# EAGLE schematic main_board (EAGLE 9.6.2)
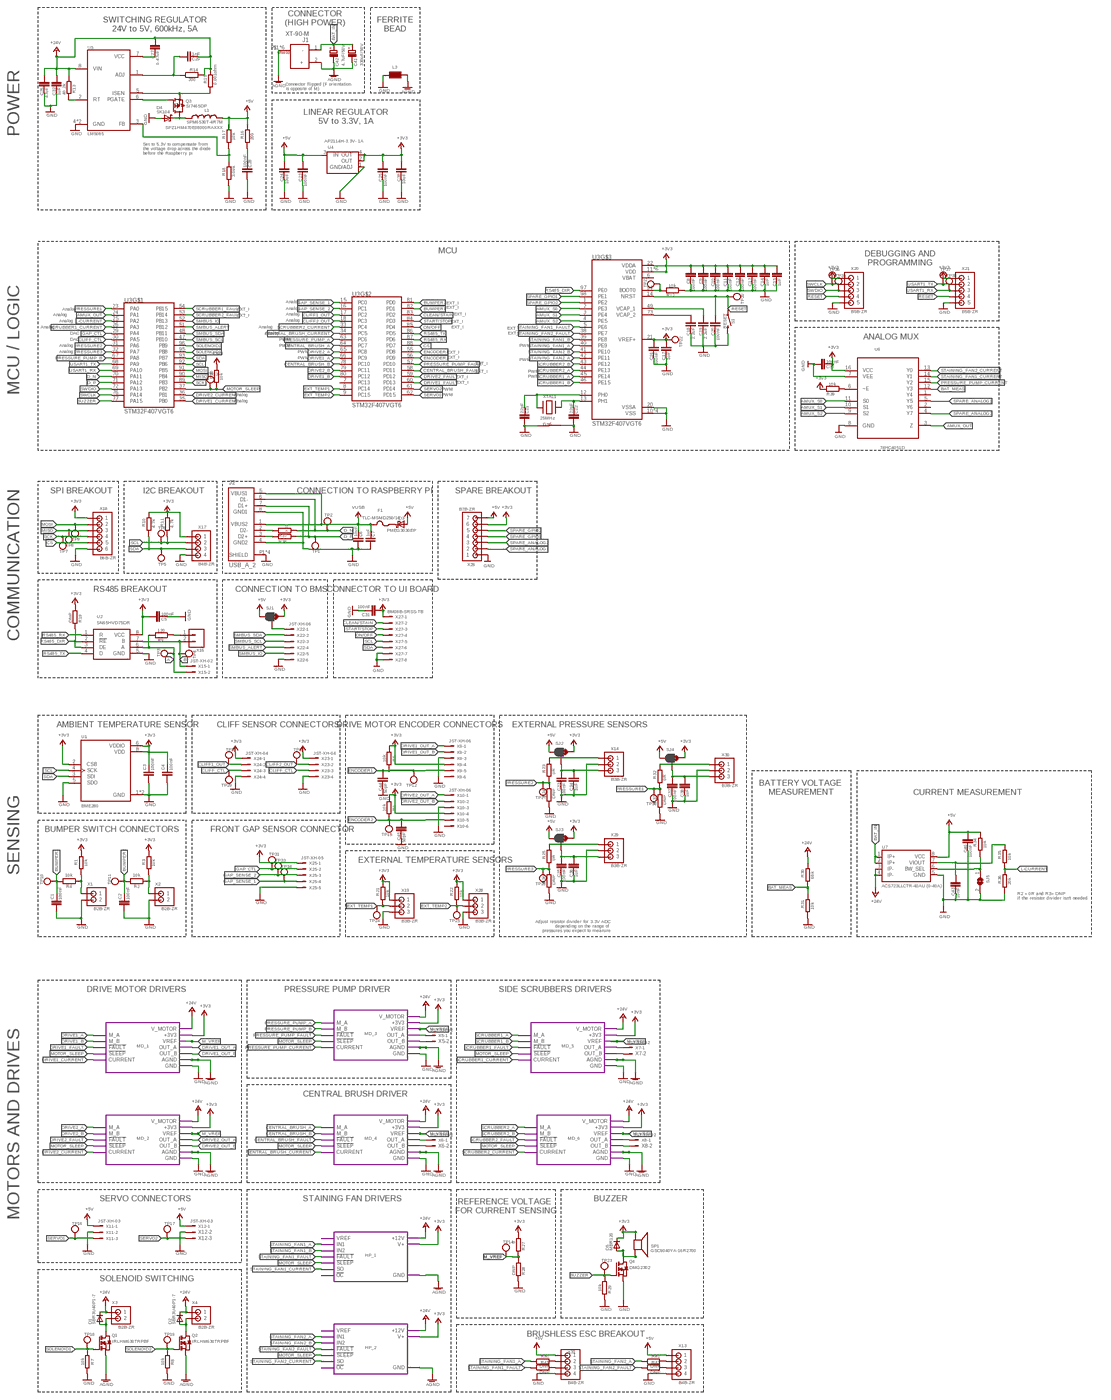
[diagram p0: schematic, sheet 1, overview]
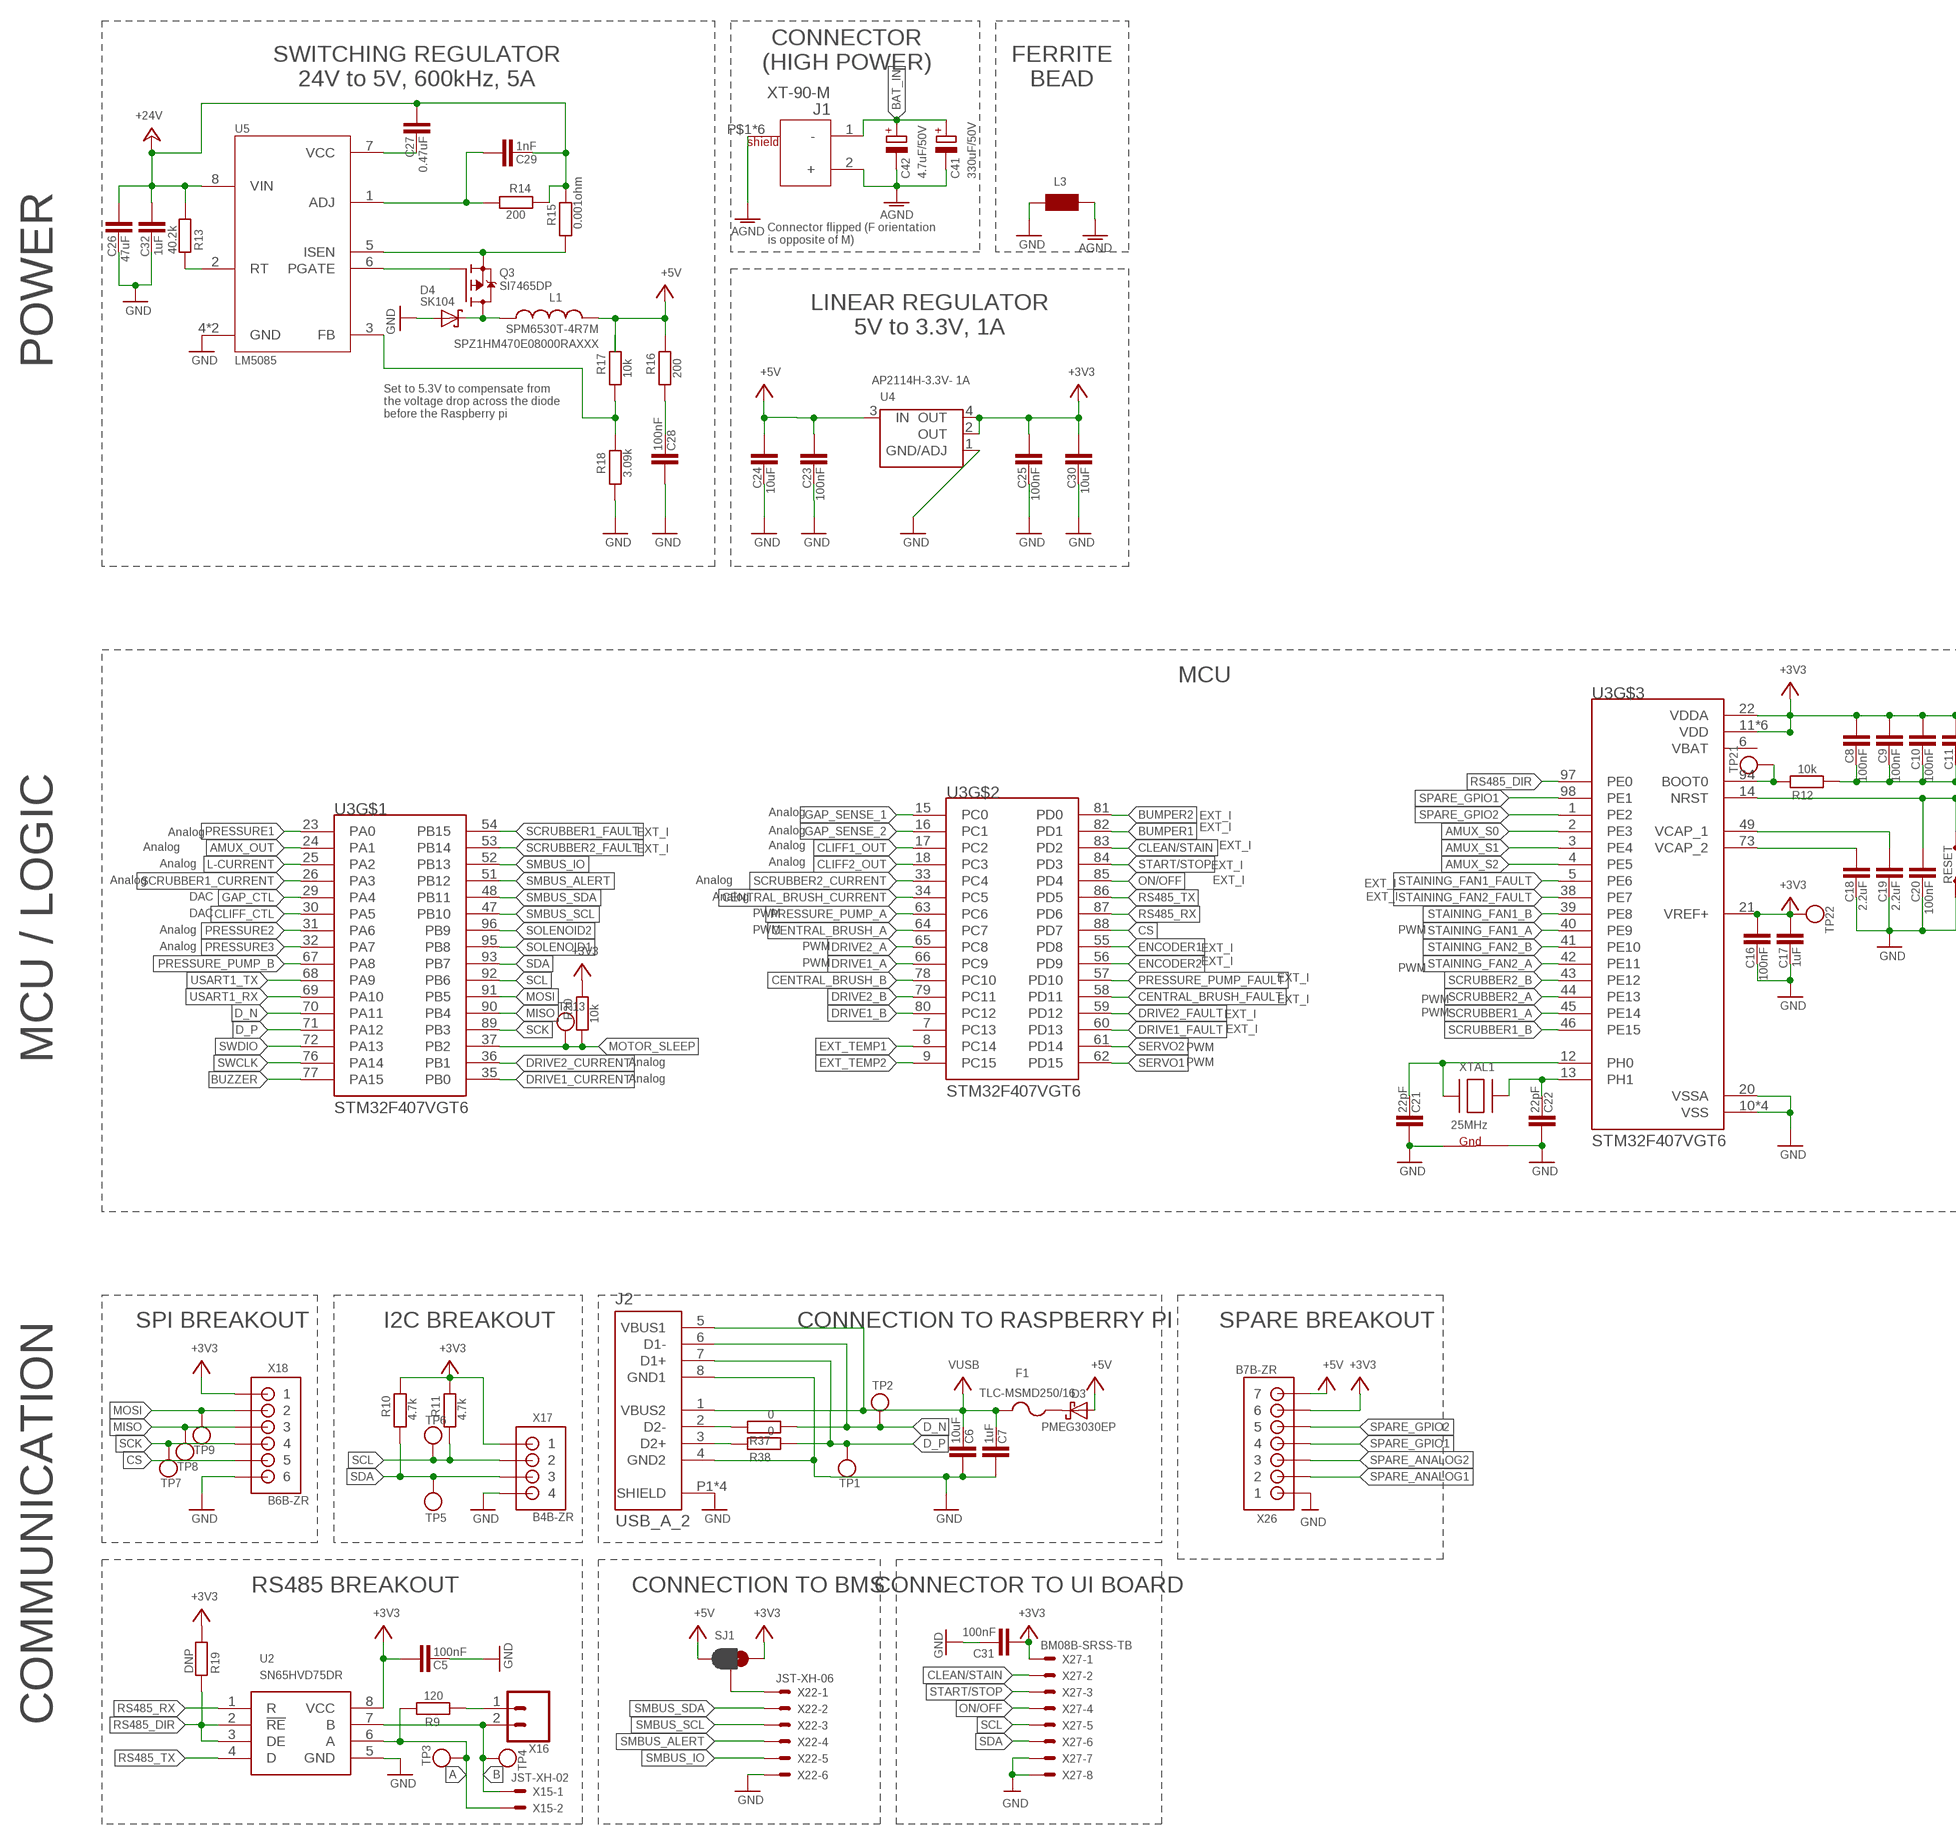
[diagram p1: schematic, sheet 1, part 1 of 4]
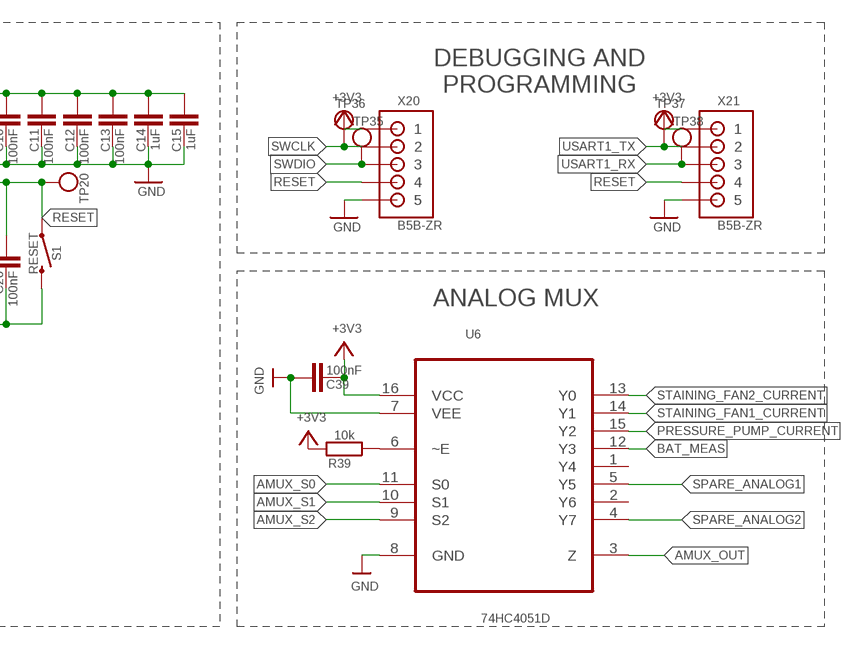
[diagram p2: schematic, sheet 1, part 2 of 4]
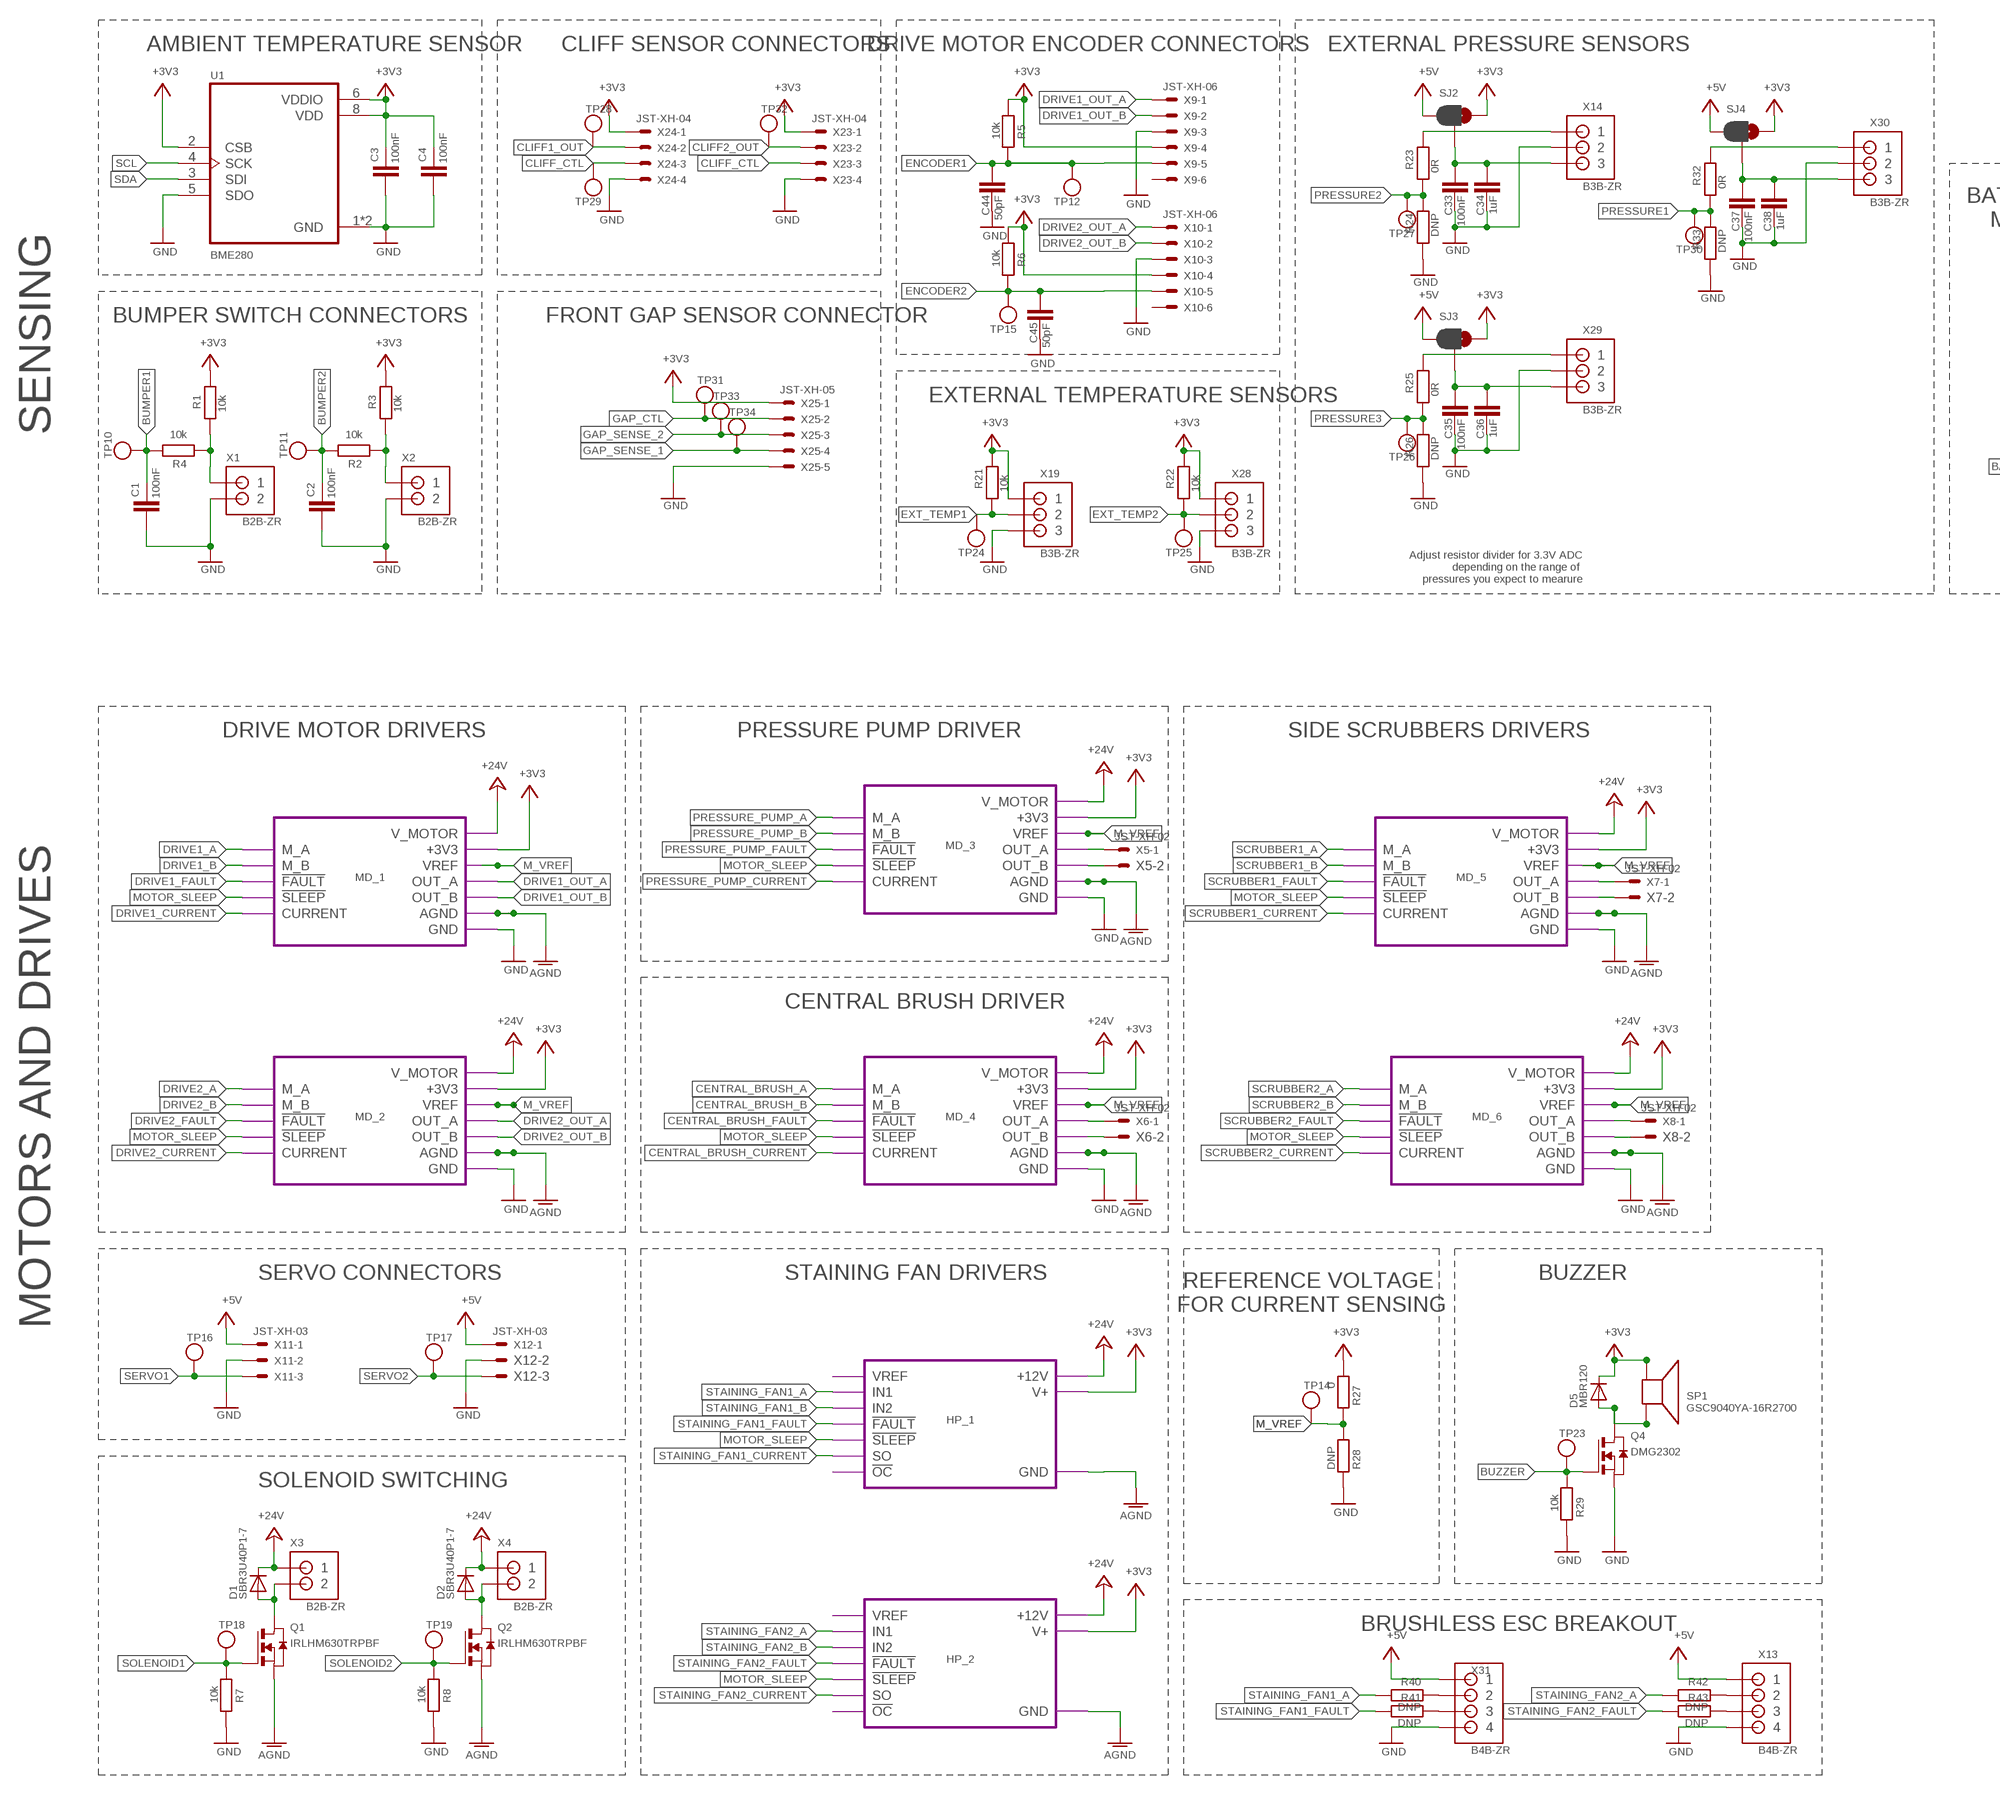
[diagram p3: schematic, sheet 1, part 3 of 4]
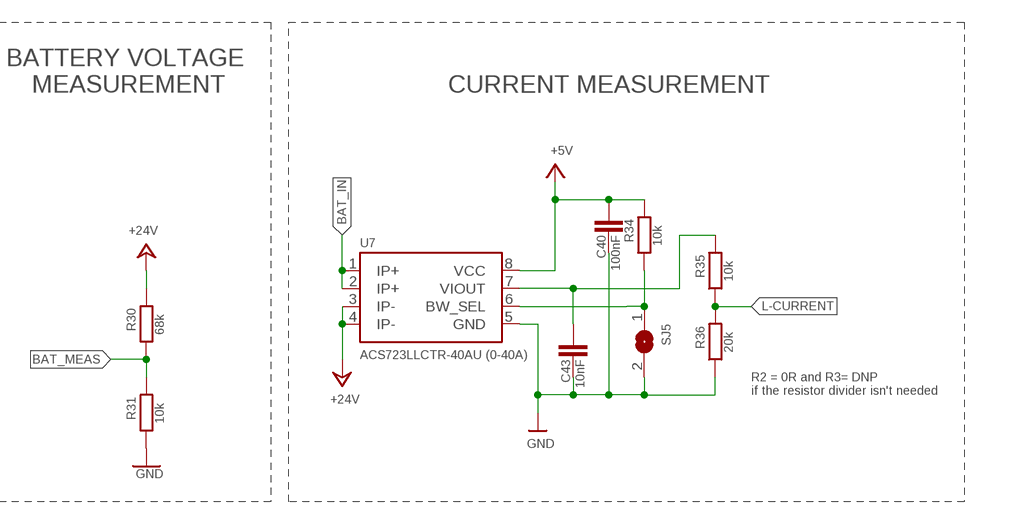
[diagram p4: schematic, sheet 1, part 4 of 4]

## Parts
C1  100nF  C-EUC0402  [C0402]
C2  100nF  C-EUC0402  [C0402]
C3  100nF  C-EUC0402  [C0402]
C4  100nF  C-EUC0402  [C0402]
C5  100nF  C-EUC0402  [C0402]
C6  10uF  C-EUC0402  [C0402]
C7  1uF  C-EUC0402  [C0402]
C8  100nF  C-EUC0402  [C0402]
C9  100nF  C-EUC0402  [C0402]
C10  100nF  C-EUC0402  [C0402]
C11  100nF  C-EUC0402  [C0402]
C12  100nF  C-EUC0402  [C0402]
C13  100nF  C-EUC0402  [C0402]
C14  1uF  C-EUC0402  [C0402]
C15  1uF  C-EUC0402  [C0402]
C16  100nF  C-EUC0402  [C0402]
C17  1uF  C-EUC0402  [C0402]
C18  2.2uF  C-EUC0402  [C0402]
C19  2.2uF  C-EUC0402  [C0402]
C20  100nF  C-EUC0402  [C0402]
C21  22pF  C-EUC0402  [C0402]
C22  22pF  C-EUC0402  [C0402]
C23  100nF  C-EUC0402  [C0402]
C24  10uF  C-EUC0805  [C0805]
C25  100nF  C-EUC0402  [C0402]
C26  47uF  C-EUC1206  [C1206]
C27  0.47uF  C-EUC1206  [C1206]
C28  100nF  C-EUC0402  [C0402]
C29  1nF  C-EUC0603  [C0603]
C30  10uF  C-EUC0805  [C0805]
C31  100nF  C-EUC0402  [C0402]
C32  1uF  C-EUC1206  [C1206]
C33  100nF  C-EUC0402  [C0402]
C34  1uF  C-EUC0402  [C0402]
C35  100nF  C-EUC0402  [C0402]
C36  1uF  C-EUC0402  [C0402]
C37  100nF  C-EUC0402  [C0402]
C38  1uF  C-EUC0402  [C0402]
C39  100nF  C-EUC0402  [C0402]
C40  100nF  C-EUC0402  [C0402]
C41  330uF/50V  CPOL-EUE2-5  [E2-5]
C42  4.7uF/50V  CPOL-EUE2-5  [E2-5]
C43  10nF  C-EUC0402  [C0402]
C44  50pF  C-EUC0402  [C0402]
C45  50pF  C-EUC0402  [C0402]
D1  SBR3U40P1-7  DIODESOD-123  [SOD-123]
D2  SBR3U40P1-7  DIODESOD-123  [SOD-123]
D3  PMEG3030EP  RB081LAM-20  [SOD-128]
D4  SK104  [SK104]
D5  MBR120  DIODESOD-123  [SOD-123]
F1  TLC-MSMD250/16  PTCFUSE-1812  [1812]
J1  XT-90-M  [XT-90-M-SIDE]
J2  USB_A_2  [TE_1903815-1]
L1  SPM6530T-4R7M  [SPM6530T-4R7M]
L3  WUERTH-ELEKTRONIK_WE-CBF_1210  [WUERTH-ELEKTRONIK_1210]
Q1  IRLHM630TRPBF  NMOS-MLP8-33  [MLP8-33]
Q2  IRLHM630TRPBF  NMOS-MLP8-33  [MLP8-33]
Q3  SI7465DP  [SI7465]
Q4  DMG2302  NMOS-SOT23  [SOT-23]
R1  10k  R-EU_R0402  [R0402]
R2  10k  R-EU_R0402  [R0402]
R3  10k  R-EU_R0402  [R0402]
R4  10k  R-EU_R0402  [R0402]
R5  10k  R-EU_R0402  [R0402]
R6  10k  R-EU_R0402  [R0402]
R7  10k  R-EU_R0402  [R0402]
R8  10k  R-EU_R0402  [R0402]
R9  120  R-EU_R0402  [R0402]
R10  4.7k  R-EU_R0402  [R0402]
R11  4.7k  R-EU_R0402  [R0402]
R12  10k  R-EU_R0402  [R0402]
R13  40.2k  R-EU_R0603  [R0603]
R14  200  R-EU_R0603  [R0603]
R15  0.001ohm  R-EU_R1206  [R1206]
R16  200  R-EU_R0402  [R0402]
R17  10k  R-EU_R0402  [R0402]
R18  3.09k  R-EU_R0402  [R0402]
R19  DNP  R-EU_R0402  [R0402]
R20  10k  R-EU_R0402  [R0402]
R21  10k  R-EU_R0402  [R0402]
R22  10k  R-EU_R0402  [R0402]
R23  0R  R-EU_R0402  [R0402]
R24  DNP  R-EU_R0402  [R0402]
R25  0R  R-EU_R0402  [R0402]
R26  DNP  R-EU_R0402  [R0402]
R27  0  R-EU_R0402  [R0402]
R28  DNP  R-EU_R0402  [R0402]
R29  10k  R-EU_R0402  [R0402]
R30  68k  R-EU_R0402  [R0402]
R31  10k  R-EU_R0402  [R0402]
R32  0R  R-EU_R0402  [R0402]
R33  DNP  R-EU_R0402  [R0402]
R34  10k  R-EU_R0402  [R0402]
R35  10k  R-EU_R0402  [R0402]
R36  20k  R-EU_R0402  [R0402]
R37  0  R-EU_R0402  [R0402]
R38  0  R-EU_R0402  [R0402]
R39  10k  R-EU_R0402  [R0402]
R40  DNP  R-EU_R0402  [R0402]
R41  DNP  R-EU_R0402  [R0402]
R42  DNP  R-EU_R0402  [R0402]
R43  DNP  R-EU_R0402  [R0402]
S1  RESET  MOMENTARY-SWITCH-SPST-SMD-5.2-REDUNDANT  [TACTILE_SWITCH_SMD_5.2MM]
SJ1  SPARKFUN-PASSIVES_JUMPER_PAD-3-1&2_NC_BY_PASTE  [SPARKFUN-PASSIVES_PAD-HUMPER-3-1&2_NC_BY_PASTE_YES_SILK_FULL_BOX]
SJ2  SPARKFUN-PASSIVES_JUMPER_PAD-3-1&2_NC_BY_PASTE  [SPARKFUN-PASSIVES_PAD-HUMPER-3-1&2_NC_BY_PASTE_YES_SILK_FULL_BOX]
SJ3  SPARKFUN-PASSIVES_JUMPER_PAD-3-1&2_NC_BY_PASTE  [SPARKFUN-PASSIVES_PAD-HUMPER-3-1&2_NC_BY_PASTE_YES_SILK_FULL_BOX]
SJ4  SPARKFUN-PASSIVES_JUMPER_PAD-3-1&2_NC_BY_PASTE  [SPARKFUN-PASSIVES_PAD-HUMPER-3-1&2_NC_BY_PASTE_YES_SILK_FULL_BOX]
SJ5  SOLDERJUMPERREFLOW_NOPASTE  [SOLDERJUMPER_REFLOW_NOPASTE]
SP1  GSC9040YA-16R2700  [GSC9040YA-16R2700]
TP1  TESTPOINTROUND1.5MM  [TESTPOINT_ROUND_1.5MM]
TP2  TESTPOINTROUND1.5MM  [TESTPOINT_ROUND_1.5MM]
TP3  TESTPOINTROUND1.5MM  [TESTPOINT_ROUND_1.5MM]
TP4  TESTPOINTROUND1.5MM  [TESTPOINT_ROUND_1.5MM]
TP5  TESTPOINTROUND1.5MM  [TESTPOINT_ROUND_1.5MM]
TP6  TESTPOINTROUND1.5MM  [TESTPOINT_ROUND_1.5MM]
TP7  TESTPOINTROUND1.5MM  [TESTPOINT_ROUND_1.5MM]
TP8  TESTPOINTROUND1.5MM  [TESTPOINT_ROUND_1.5MM]
TP9  TESTPOINTROUND1.5MM  [TESTPOINT_ROUND_1.5MM]
TP10  TESTPOINTROUND1.5MM  [TESTPOINT_ROUND_1.5MM]
TP11  TESTPOINTROUND1.5MM  [TESTPOINT_ROUND_1.5MM]
TP12  TESTPOINTROUND1.5MM  [TESTPOINT_ROUND_1.5MM]
TP13  TESTPOINTROUND1.5MM  [TESTPOINT_ROUND_1.5MM]
TP14  TESTPOINTROUND1.5MM  [TESTPOINT_ROUND_1.5MM]
TP15  TESTPOINTROUND1.5MM  [TESTPOINT_ROUND_1.5MM]
TP16  TESTPOINTROUND1.5MM  [TESTPOINT_ROUND_1.5MM]
TP17  TESTPOINTROUND1.5MM  [TESTPOINT_ROUND_1.5MM]
TP18  TESTPOINTROUND1.5MM  [TESTPOINT_ROUND_1.5MM]
TP19  TESTPOINTROUND1.5MM  [TESTPOINT_ROUND_1.5MM]
TP20  TESTPOINTROUND1.5MM  [TESTPOINT_ROUND_1.5MM]
TP21  TESTPOINTROUND1.5MM  [TESTPOINT_ROUND_1.5MM]
TP22  TESTPOINTROUND1.5MM  [TESTPOINT_ROUND_1.5MM]
TP23  TESTPOINTROUND1.5MM  [TESTPOINT_ROUND_1.5MM]
TP24  TESTPOINTROUND1.5MM  [TESTPOINT_ROUND_1.5MM]
TP25  TESTPOINTROUND1.5MM  [TESTPOINT_ROUND_1.5MM]
TP26  TESTPOINTROUND1.5MM  [TESTPOINT_ROUND_1.5MM]
TP27  TESTPOINTROUND1.5MM  [TESTPOINT_ROUND_1.5MM]
TP28  TESTPOINTROUND1.5MM  [TESTPOINT_ROUND_1.5MM]
TP29  TESTPOINTROUND1.5MM  [TESTPOINT_ROUND_1.5MM]
TP30  TESTPOINTROUND1.5MM  [TESTPOINT_ROUND_1.5MM]
TP31  TESTPOINTROUND1.5MM  [TESTPOINT_ROUND_1.5MM]
TP32  TESTPOINTROUND1.5MM  [TESTPOINT_ROUND_1.5MM]
TP33  TESTPOINTROUND1.5MM  [TESTPOINT_ROUND_1.5MM]
TP34  TESTPOINTROUND1.5MM  [TESTPOINT_ROUND_1.5MM]
TP35  TESTPOINTROUND1.5MM  [TESTPOINT_ROUND_1.5MM]
TP36  TESTPOINTROUND1.5MM  [TESTPOINT_ROUND_1.5MM]
TP37  TESTPOINTROUND1.5MM  [TESTPOINT_ROUND_1.5MM]
TP38  TESTPOINTROUND1.5MM  [TESTPOINT_ROUND_1.5MM]
U1  BME280  [PSON65P250X250X100-8N]
U2  SN65HVD75DR  [SOIC127P600X175-8N]
U3  STM32F407VGT6  [QFP50P1600X1600X160-100N]
U4  AP2114H-3.3V- 1A  GEN_COMP_LINEAR_MC33269ST  [GEN_COMP_SOT223]
U5  LM5085  [LM5085]
U6  74HC4051D  [SOIC127P600X175-16N]
U7  ACS723LLCTR-40AU (0-40A)  SPARKFUN-SENSORS_ACS723  [SPARKFUN-SENSORS_SO08]
X1  B2B-ZR  [B2B-ZR]
X2  B2B-ZR  [B2B-ZR]
X3  B2B-ZR  [B2B-ZR]
X4  B2B-ZR  [B2B-ZR]
X5  JST-XH-02  JST-XH-02-PIN-ROUND-PAD  [JST-XH-02]
X6  JST-XH-02  JST-XH-02-PIN-ROUND-PAD  [JST-XH-02]
X7  JST-XH-02  JST-XH-02-PIN-ROUND-PAD  [JST-XH-02]
X8  JST-XH-02  JST-XH-02-PIN-ROUND-PAD  [JST-XH-02]
X9  JST-XH-06  JST-XH-06-PIN-ROUND-PAD  [JST-XH-06]
X10  JST-XH-06  JST-XH-06-PIN-ROUND-PAD  [JST-XH-06]
X11  JST-XH-03  JST-XH-03-PIN"  [JST-XH-03]
X12  JST-XH-03  JST-XH-03-PIN"  [JST-XH-03]
X13  B4B-ZR  [B4B-ZR]
X14  B3B-ZR  [B3B-ZR]
X15  JST-XH-02  JST-XH-02-PIN-ROUND-PAD  [JST-XH-02]
X16  CONN_02  [1X02]
X17  B4B-ZR  [B4B-ZR]
X18  B6B-ZR  [B6B-ZR]
X19  B3B-ZR  [B3B-ZR]
X20  B5B-ZR  [B5B-ZR]
X21  B5B-ZR  [B5B-ZR]
X22  JST-XH-06  JST-XH-06-PIN-ROUND-PAD  [JST-XH-06]
X23  JST-XH-04  JST-XH-04-PIN"  [JST-XH-04]
X24  JST-XH-04  JST-XH-04-PIN"  [JST-XH-04]
X25  JST-XH-05  JST-XH-05-PIN-ROUND-PAD  [JST-XH-05]
X26  B7B-ZR  [B7B-ZR]
X27  BM08B-SRSS-TB  [BM08B-SRSS-TB]
X28  B3B-ZR  [B3B-ZR]
X29  B3B-ZR  [B3B-ZR]
X30  B3B-ZR  [B3B-ZR]
X31  B4B-ZR  [B4B-ZR]
XTAL1  25MHz  XTAL-4-3225  [NX3225]

## Module instances
MD_1 = MD
MD_2 = MD
MD_3 = MD
MD_4 = MD
MD_5 = MD
MD_6 = MD
HP_1 = HP
HP_2 = HP

## Nets
+3V3: C3.1 C4.1 C5.1 C8.1 C9.1 C10.1 C11.1 C12.1 C13.1 C14.1 C15.1 C16.1 C17.1 C25.1 C30.1 C31.2 C39.2 D5.C R1.2 R3.2 R5.1 R6.1 R10.2 R11.2 R19.1 R20.2 R21.2 R22.2 R27.1 R39.2 SJ1.3 SJ2.3 SJ3.3 SJ4.3 SP1.P$3(+) TP22.P$1 U1.2(CSB) U1.6(VDDIO) U1.8(VDD) U2.8(VCC) U3.11(VDD) U3.19(VDD) U3.21(VREF+) U3.22(VDDA) U3.28(VDD) U3.50(VDD) U3.75(VDD) U3.100(VDD) U4.2(OUT) U4.4(OUT) U6.16(VCC) X9.4 X10.4 X17.1 X18.1 X19.1 X20.1 X21.1 X23.1 X24.1 X25.1 X26.6 X27.1 X28.1 ; port MD_1.+3V3 MD_2.+3V3 MD_3.+3V3 MD_4.+3V3 MD_5.+3V3 MD_6.+3V3 HP_1.V+ HP_2.V+
+5V: C23.1 C24.1 C40.1 D3.A L1.2 R16.2 R17.2 R34.2 SJ1.1 SJ2.1 SJ3.1 SJ4.1 U4.3(IN) U7.8(VCC) X11.1 X12.1 X13.1 X26.7 X31.1
+24V: C26.1 C27.1 C29.2 C32.1 D1.C D2.C R13.1 R14.2 R15.2 R30.2 U5.8(VIN) U7.3(IP-) U7.4(IP-) X3.1 X4.1 ; port MD_1.V_MOTOR MD_2.V_MOTOR MD_3.V_MOTOR MD_4.V_MOTOR MD_5.V_MOTOR MD_6.V_MOTOR HP_1.+12V HP_2.+12V
A: R9.2 TP3.P$1 U2.6(A) X15.2
AGND: C41.- C42.- J1.2(+) J1.P$1(SHIELD) J1.P$2(SHIELD) J1.P$3(SHIELD) J1.P$4(SHIELD) J1.P$5(SHIELD) J1.P$6(SHIELD) L3.2 Q1.S1(S) Q1.S2(S) Q1.S3(S) Q2.S1(S) Q2.S2(S) Q2.S3(S) ; port MD_1.AGND MD_3.AGND MD_4.AGND MD_2.AGND MD_5.AGND MD_6.AGND HP_1.GND HP_2.GND
AMUX_OUT: U3.24(PA1) U6.3(Z)
AMUX_S0: U3.2(PE3) U6.11(S0)
AMUX_S1: U3.3(PE4) U6.10(S1)
AMUX_S2: U3.4(PE5) U6.9(S2)
B: TP4.P$1 U2.7(B) X15.1 X16.2
BAT_IN: C41.+ C42.+ J1.1(-) U7.1(IP+) U7.2(IP+)
BAT_MEAS: R30.1 R31.2 U6.12(Y3)
BUMPER1: C1.1 R4.2 TP10.P$1 U3.82(PD1)
BUMPER2: C2.1 R2.2 TP11.P$1 U3.81(PD0)
BUZZER: Q4.G R29.1 TP23.P$1 U3.77(PA15)
CENTRAL_BRUSH_A: U3.64(PC7) ; port MD_4.M_A
CENTRAL_BRUSH_B: U3.78(PC10) ; port MD_4.M_B
CENTRAL_BRUSH_CURRENT: U3.34(PC5) ; port MD_4.CURRENT
CENTRAL_BRUSH_FAULT: U3.58(PD11) ; port MD_4.!FAULT
CLEAN/STAIN: U3.83(PD2) X27.2
CLIFF1_OUT: TP28.P$1 U3.17(PC2) X24.2
CLIFF2_OUT: TP32.P$1 U3.18(PC3) X23.2
CLIFF_CTL: TP29.P$1 U3.30(PA5) X23.3 X24.3
CS: U3.88(PD7) X18.5
D_N: J2.6(D1-) R37.1 TP2.P$1 U3.70(PA11)
D_P: J2.7(D1+) R38.1 TP1.P$1 U3.71(PA12)
DRIVE1_A: U3.66(PC9) ; port MD_1.M_A
DRIVE1_B: U3.80(PC12) ; port MD_1.M_B
DRIVE1_CURRENT: U3.35(PB0) ; port MD_1.CURRENT
DRIVE1_FAULT: U3.60(PD13) ; port MD_1.!FAULT
DRIVE1_OUT_A: X9.1 ; port MD_1.OUT_A
DRIVE1_OUT_B: X9.2 ; port MD_1.OUT_B
DRIVE2_A: U3.65(PC8) ; port MD_2.M_A
DRIVE2_B: U3.79(PC11) ; port MD_2.M_B
DRIVE2_CURRENT: U3.36(PB1) ; port MD_2.CURRENT
DRIVE2_FAULT: U3.59(PD12) ; port MD_2.!FAULT
DRIVE2_OUT_A: X10.1 ; port MD_2.OUT_A
DRIVE2_OUT_B: X10.2 ; port MD_2.OUT_B
ENCODER1: C44.1 R5.2 TP12.P$1 U3.55(PD8) X9.5
ENCODER2: C45.1 R6.2 TP15.P$1 U3.56(PD9) X10.5
EXT_TEMP1: R21.1 TP24.P$1 U3.8(PC14) X19.2
EXT_TEMP2: R22.1 TP25.P$1 U3.9(PC15) X28.2
GAP_CTL: TP31.P$1 U3.29(PA4) X25.2
GAP_SENSE_1: TP34.P$1 U3.15(PC0) X25.4
GAP_SENSE_2: TP33.P$1 U3.16(PC1) X25.3
GND: C1.2 C2.2 C3.2 C4.2 C5.2 C6.1 C7.1 C8.2 C9.2 C10.2 C11.2 C12.2 C13.2 C14.2 C15.2 C16.2 C17.2 C18.2 C19.2 C20.2 C21.1 C22.1 C23.2 C24.2 C25.2 C26.2 C28.1 C30.2 C31.1 C32.2 C33.2 C34.2 C35.2 C36.2 C37.2 C38.2 C39.1 C40.2 C43.2 C44.2 C45.2 D4.1(A) J2.4(GND2) J2.8(GND1) J2.P1(SHIELD) J2.P2(SHIELD) J2.P3(SHIELD) J2.P4(SHIELD) L3.1 Q4.S R7.2 R8.2 R12.1 R18.1 R24.1 R26.1 R28.2 R29.2 R31.1 R33.1 R36.1 S1.3 S1.4 SJ5.2 U1.1(GND) U1.5(SDO) U1.7(GND) U2.5(GND) U3.10(VSS) U3.20(VSSA) U3.27(VSS) U3.74(VSS) U3.99(VSS) U4.1(GND/ADJ) U5.4(GND) U5.9(GND) U6.7(VEE) U6.8(GND) U7.5(GND) X1.2 X2.2 X9.3 X10.3 X11.2 X12.2 X13.4 X14.2 X17.4 X18.6 X19.3 X20.5 X21.5 X22.6 X23.4 X24.4 X25.5 X26.1 X27.7 X27.8 X28.3 X29.2 X30.2 X31.4 XTAL1.2(G2) XTAL1.4(G1) ; port MD_1.GND MD_2.GND MD_3.GND MD_4.GND MD_5.GND MD_6.GND
L-CURRENT: R35.1 R36.2 U3.25(PA2)
M_VREF: R27.2 R28.1 TP14.P$1 ; port MD_1.VREF MD_3.VREF MD_4.VREF MD_2.VREF MD_5.VREF MD_6.VREF
MISO: TP8.P$1 U3.90(PB4) X18.3
MOSI: TP9.P$1 U3.91(PB5) X18.2
MOTOR_SLEEP: R20.1 TP13.P$1 U3.37(PB2) ; port MD_1.!SLEEP MD_2.!SLEEP MD_3.!SLEEP MD_4.!SLEEP MD_5.!SLEEP MD_6.!SLEEP HP_1.!SLEEP HP_2.!SLEEP
N$1: R2.1 R3.1 X2.1
N$2: X5.1 ; port MD_3.OUT_A
N$3: R1.1 R4.1 X1.1
N$4: X5.2 ; port MD_3.OUT_B
N$5: X7.1 ; port MD_5.OUT_A
N$6: X7.2 ; port MD_5.OUT_B
N$7: X8.1 ; port MD_6.OUT_A
N$8: X8.2 ; port MD_6.OUT_B
N$9: X6.1 ; port MD_4.OUT_A
N$10: X6.2 ; port MD_4.OUT_B
N$11: D2.A Q2.D1(D) Q2.D2(D) Q2.D3(D) Q2.D4(D) Q2.DRAIN0(D) X4.2
N$12: D1.A Q1.D1(D) Q1.D2(D) Q1.D3(D) Q1.D4(D) Q1.DRAIN0(D) X3.2
N$13: R9.1 X16.1
N$14: C18.1 U3.73(VCAP_2)
N$15: C19.1 U3.49(VCAP_1)
N$16: R12.2 TP21.P$1 U3.94(BOOT0)
N$17: SJ1.2 X22.1
N$18: D3.K F1.1
N$19: D5.A Q4.D SP1.P$2(-)
N$20: R23.2 X14.1
N$21: C33.1 C34.1 SJ2.2 X14.3
N$22: R25.2 X29.1
N$23: C28.2 R16.1
N$24: C35.1 C36.1 SJ3.2 X29.3
N$25: R32.2 X30.1
N$26: C37.1 C38.1 SJ4.2 X30.3
N$27: R13.2 U5.2(RT)
N$28: C43.1 R35.2 U7.7(VIOUT)
N$29: J2.2(D2-) R37.2
N$30: J2.3(D2+) R38.2
N$31: R34.1 SJ5.1 U7.6(BW_SEL)
N$32: R42.2 X13.2
N$33: R39.1 U6.6(~E)
N$34: R43.2 X13.3
N$37: R40.2 X31.2
N$38: R41.2 X31.3
N$39: Q3.1(S) Q3.2(S) Q3.3(S) R15.1 U5.5(ISEN)
N$41: C29.1 R14.1 U5.1(ADJ)
N$43: R17.1 R18.2 U5.3(FB)
N$46: C27.2 U5.7(VCC)
N$50: D4.2(C) L1.1 Q3.5(D) Q3.6(D) Q3.7(D) Q3.8(D) Q3.9(D)
N$51: Q3.4(G) U5.6(PGATE)
ON/OFF: U3.85(PD4) X27.4
PRESSURE1: R32.1 R33.2 TP30.P$1 U3.23(PA0)
PRESSURE2: R23.1 R24.2 TP27.P$1 U3.31(PA6)
PRESSURE3: R25.1 R26.2 TP26.P$1 U3.32(PA7)
PRESSURE_PUMP_A: U3.63(PC6) ; port MD_3.M_A
PRESSURE_PUMP_B: U3.67(PA8) ; port MD_3.M_B
PRESSURE_PUMP_CURRENT: U6.15(Y2) ; port MD_3.CURRENT
PRESSURE_PUMP_FAULT: U3.57(PD10) ; port MD_3.!FAULT
RESET: C20.1 S1.1 S1.2 TP20.P$1 U3.14(NRST) X20.4 X21.4
RS485_DIR: R19.2 U2.2(!RE) U2.3(DE) U3.97(PE0)
RS485_RX: U2.1(R) U3.87(PD6)
RS485_TX: U2.4(D) U3.86(PD5)
SCK: TP7.P$1 U3.89(PB3) X18.4
SCL: R11.1 TP6.P$1 U1.4(SCK) U3.92(PB6) X17.2 X27.5
SCRUBBER1_A: U3.45(PE14) ; port MD_5.M_A
SCRUBBER1_B: U3.46(PE15) ; port MD_5.M_B
SCRUBBER1_CURRENT: U3.26(PA3) ; port MD_5.CURRENT
SCRUBBER1_FAULT: U3.54(PB15) ; port MD_5.!FAULT
SCRUBBER2_A: U3.44(PE13) ; port MD_6.M_A
SCRUBBER2_B: U3.43(PE12) ; port MD_6.M_B
SCRUBBER2_CURRENT: U3.33(PC4) ; port MD_6.CURRENT
SCRUBBER2_FAULT: U3.53(PB14) ; port MD_6.!FAULT
SDA: R10.1 TP5.P$1 U1.3(SDI) U3.93(PB7) X17.3 X27.6
SERVO1: TP16.P$1 U3.62(PD15) X11.3
SERVO2: TP17.P$1 U3.61(PD14) X12.3
SMBUS_ALERT: U3.51(PB12) X22.4
SMBUS_IO: U3.52(PB13) X22.5
SMBUS_SCL: U3.47(PB10) X22.3
SMBUS_SDA: U3.48(PB11) X22.2
SOLENOID1: Q1.GATE(G) R7.1 TP18.P$1 U3.95(PB8)
SOLENOID2: Q2.GATE(G) R8.1 TP19.P$1 U3.96(PB9)
SPARE_ANALOG1: U6.5(Y5) X26.2
SPARE_ANALOG2: U6.4(Y7) X26.3
SPARE_GPIO1: U3.98(PE1) X26.4
SPARE_GPIO2: U3.1(PE2) X26.5
STAINING_FAN1_A: R40.1 U3.40(PE9) ; port HP_1.IN1
STAINING_FAN1_B: U3.39(PE8) ; port HP_1.IN2
STAINING_FAN1_CURRENT: U6.14(Y1) ; port HP_1.SO
STAINING_FAN1_FAULT: R41.1 U3.5(PE6) ; port HP_1.!FAULT
STAINING_FAN2_A: R42.1 U3.42(PE11) ; port HP_2.IN1
STAINING_FAN2_B: U3.41(PE10) ; port HP_2.IN2
STAINING_FAN2_CURRENT: U6.13(Y0) ; port HP_2.SO
STAINING_FAN2_FAULT: R43.1 U3.38(PE7) ; port HP_2.!FAULT
START/STOP: U3.84(PD3) X27.3
SWCLK: TP36.P$1 U3.76(PA14) X20.2
SWDIO: TP35.P$1 U3.72(PA13) X20.3
USART1_RX: TP38.P$1 U3.69(PA10) X21.3
USART1_TX: TP37.P$1 U3.68(PA9) X21.2
VUSB: C6.2 C7.2 F1.2 J2.1(VBUS2) J2.5(VBUS1)
X_N: C22.2 U3.13(PH1) XTAL1.3(X2)
X_P: C21.2 U3.12(PH0) XTAL1.1(X1)
Unconnected: U3.7(PC13) U6.1(Y4) U6.2(Y6) X9.6 X10.6

## Notes on the sheet
- CONNECTOR
  (HIGH POWER)
- SWITCHING REGULATOR
  24V to 5V, 600kHz, 5A
- FERRITE
  BEAD
- Connector flipped (F orientation 
  is opposite of M)
- LINEAR REGULATOR
  5V to 3.3V, 1A
- SPZ1HM470E08000RAXXX
- POWER
- Set to 5.3V to compensate from
  the voltage drop across the diode
  before the Raspberry pi
- MCU
- DEBUGGING AND
  PROGRAMMING
- Analog
- EXT_I
- Analog | Analog
- EXT_I
- EXT_I
- Analog | Analog
- EXT_I
- EXT_I
- Analog | Analog
- EXT_I
- Analog | Analog | EXT_I
- EXT_I
- DAC | Analog | EXT_I
- DAC | PWM
- ANALOG MUX
- Analog | PWM | PWM
- Analog | PWM
- EXT_I
- PWM
- EXT_I | PWM
- EXT_I
- PWM
- EXT_I
- PWM
- EXT_I
- EXT_I
- PWM
- MCU / LOGIC
- Analog | PWM
- Analog
- SPI BREAKOUT | I2C BREAKOUT | CONNECTION TO RASPBERRY PI | SPARE BREAKOUT
- RS485 BREAKOUT | CONNECTION TO BMS | CONNECTOR TO UI BOARD
- COMMUNICATION
- AMBIENT TEMPERATURE SENSOR | CLIFF SENSOR CONNECTORS | DRIVE MOTOR ENCODER CONNECTORS | EXTERNAL PRESSURE SENSORS
- BATTERY VOLTAGE 
  MEASUREMENT
- CURRENT MEASUREMENT
- BUMPER SWITCH CONNECTORS | FRONT GAP SENSOR CONNECTOR
- EXTERNAL TEMPERATURE SENSORS
- SENSING
- R2 = 0R and R3= DNP
  if the resistor divider isn't needed
- Adjust resistor divider for 3.3V ADC
  depending on the range of 
  pressures you expect to mearure
- DRIVE MOTOR DRIVERS | PRESSURE PUMP DRIVER | SIDE SCRUBBERS DRIVERS
- CENTRAL BRUSH DRIVER
- SERVO CONNECTORS | STAINING FAN DRIVERS | BUZZER
- REFERENCE VOLTAGE 
  FOR CURRENT SENSING
- MOTORS AND DRIVES
- SOLENOID SWITCHING
- BRUSHLESS ESC BREAKOUT

## Power pins joined to a net without a drawn wire
VBAT: U3.6(VBAT)

## Library data of the parts
C1-C40 C43-C45 = rcl:C-EU: CAPACITOR, European symbol; SPICEPREFIX: C
C41 C42 = rcl:CPOL-EU: POLARIZED CAPACITOR, European symbol; SPICEPREFIX: C
D1 D2 D5 = adafruit:DIODE: Diode SMADIODE - SMA Surface Mount Package 20V 1A Schottky Diode Digikey: 641-1014-6-ND DO-1N4148 - Through Hole Small Current Diode SOD-123 20V 1 A (.5mV Vf) Schottky Diode - Digikey: MBRX120TPMSCT-ND SOD-323 10V 570mA (.38mV Vf, 3ns) Schottky Diode - Digikey: ZLLS410CT-ND SOD-523 30V 30mA Schottky Diode (RB751S-40TE61) - Digikey: RB751S-40TE61CT-ND SOT23-R/W - SOT23 Package (R = Solder Paste/Reflow Ovens, W = Hand-Soldering) BAT54Film 40V 300mA - Digikey: 497-7162-1-ND
D3 = diodes:RB081LAM
D4 = Neptune_custom_lib:SK104
F1 = adafruit:PTCFUSE: PTC fuses, resettable thermistors
J1 = con-XT:XT-90-M
J2 = USB_con:USB_A_2: Conn USB 2.0 Type A RCP 4/4 POS 2.5mm Solder RA Thru-Hole 8 Terminal 2 Port Tray; AVAILABILITY: Unavailable; COMMENT: 1903815-1; COMPATIBLE_PARTS: keystone 922, lcsc C2341; DESCRIPTION: Conn USB 2.0 Type A RCP 4/4 POS 2.5mm Solder RA Thru-Hole 8 Terminal 2 Port Tray; MF: TE Connectivity; MP: 1903815-1; PACKAGE: None; PRICE: None; TE_PURCHASE_URL: https://www.te.com/usa-en/product-1903815-1.html?te_bu=Cor&te_type=disp&te_campaign=seda_glo_cor-seda-global-disp-prtnr-fy19-seda-model-bom-cta_sma-317_1&elqCampaignId=32493
L1 = Neptune_custom_lib:SPM6530T-4R7M
L3 = Lockbird_Laser_001:WUERTH-ELEKTRONIK_WE-CBF: SMD EMI Suppression Ferrite Beads - excellent anti-EMI properties - low DCR - impedances till 3000 ohms - rated current up to 6 A
Q1 Q2 Q4 = MOSFET:NMOS: N-Channel MOSFET
Q3 = Neptune_custom_lib:SI7465DP
R1-R43 = rcl:R-EU_: RESISTOR, European symbol; SPICEPREFIX: R
S1 = SparkFun-Switches:MOMENTARY-SWITCH-SPST: Momentary Switch (Pushbutton) - SPST Normally-open (NO) SPST momentary switches (buttons, pushbuttons). Variants PTH-12MM - 12mm square, through-hole Momentary Pushbutton Switch - 12mm Square <https://www.sparkfun.com/products/9190> (COM-09190) PTH-6.0MM, PTH-6.0MM-KIT - 6.0mm square, through-hole Mini Pushbutton Switch <https://www.sparkfun.com/products/97> (COM-00097) KIT package intended for soldering kit's - only one side of pads' copper is exposed. PTH-RIGHT-ANGLE-KIT - Right-angle, through-hole Right Angle Tactile Button <https://www.sparkfun.com/products/10791> - Used on SparkFun BigTime Watch Kit <https://www.sparkfun.com/products/11734> SMD-12MM - 12mm square, surface-mount Tactile Button - SMD (12mm) <https://www.sparkfun.com/products/12993> (COM-12993) Used on SparkFun PicoBoard <https://www.sparkfun.com/products/11888> SMD-4.5MM - 4.5mm Square Trackball Switch Used on SparkFun Blackberry Trackballer Breakout <https://www.sparkfun.com/products/13169> SMD-4.6MMX2.8MM - 4.60mm x 2.80mm, surface mount Used on SparkFun SAMD21 Mini Breakout <https://www.sparkfun.com/products/13664> SMD-5.2MM, SMD-5.2-REDUNDANT - 5.2mm square, surface-mount Mini Pushbutton Switch - SMD <https://www.sparkfun.com/products/8720> (COM-08720) Used on Arduino Pro Mini <https://www.sparkfun.com/products/11114> REDUNDANT package connects both switch circuits together SMD-6.0X3.5MM - 6.0 x 3.5mm, surface mount Momentary Reset Switch SMD <https://www.sparkfun.com/products/8229> (COM-08229) SMD-6.2MM-TALL - 6.2mm square, surface mount Tactile Button - SMD (6mm) <https://www.sparkfun.com/products/12992> Used on SparkFun Digital Sandbox <https://www.sparkfun.com/products/12651> SMD-RIGHT-ANGLE - Right-angle, surface mount Used on SparkFun Block for Intel® Edison - Arduino <https://www.sparkfun.com/products/13036>; PROD_ID: SWCH-08247; SF_SKU: COM-08720
SJ1-SJ4 = SparkFun_MPU-9250_Breakout:SPARKFUN-PASSIVES_JUMPER_PAD-3-1&2_NC_BY_PASTE
SJ5 = microbuilder:SOLDERJUMPER: SMD Solder JUMPER Solder the two pads together to create a connection, or remove the solder to break it. REFLOW - Use this footprint for solder paste and reflow ovens. WAVE - Use this footprint for hand-soldering (larger pads). CLOSED - Has a trace between the two pads to ensure it is closed by default. The trace needs to be cut to disable the jumper, and can be closed again by creating a solder bridge between the two pads.
SP1 = EasyCheck:GSC9040YA-16R2700
TP1-TP38 = microbuilder:TESTPOINT: Test Point Various test points for characterisation and PCB testing TESTPOINT_SMT - Compact Surface Mount Test Point [Digikey: 5016KTR-ND]
U1 = BME280:BME280: DIGITAL HUMIDITY, PRESSURE AND TEMPERATURE SENSOR * Digital interface I²C (up to 3.4 MHz) and SPI (3 and 4 wire, up to 10 MHz)* Supply voltage VDD main supply voltage range: 1.71 V to 3.6 V*VDDIO interface voltage range: 1.2 V to 3.6 V Operating range -40…+85 °C, 0…100 % rel. humidity, 300…1100 hPa The library has been designed by Richard Magdycz <https://www.facebook.com/groups/eaglecadsoftUK>; AVAILABILITY: Unavailable; DESCRIPTION: Humidity Temperature Sensor 0 ~ 100% RH I²C, SPI ±3% 1s Surface Mount; MF: Bosch; MP: BME280; PACKAGE: LGA-8 Bosch; PRICE: None
U2 = SN65HVD75DR:SN65HVD75DR: 3.3-V half-duplex RS-485 transceiver with IEC ESD, 20 Mbps Source: Datasheet <http://www.ti.com/lit/gpn/sn65hvd75>; AVAILABILITY: Unavailable; DESCRIPTION: 1/1 Transceiver Half RS422, RS485 8-SOIC; MF: Texas Instruments; MP: SN65HVD75DR; PACKAGE: SOIC-8 Texas Instruments; PRICE: None
U3 = STM32F407VGT6:STM32F407VGT6: STM32 Series 32-bit 1 MB Flash 192 kB RAM ARM Based Microcontroller - LQFP-100; AVAILABILITY: Unavailable; DESCRIPTION: ARM® Cortex®-M4 STM32F4 Microcontroller IC 32-Bit 168MHz 1MB _1M x 8_ FLASH 100-LQFP _14x14_; MF: STMicroelectronics; MP: STM32F407VGT6; PACKAGE: LQFP-100 STMicroelectronics; PRICE: None
U4 = Arduino_Micro:GEN_COMP_LINEAR_MC33269ST*: Adjustable Output Low Dropout Voltage Regulator 800 mA Source: http://www.onsemi.com/pub/Collateral/MC33269-D.PDF
U5 = Neptune_custom_lib:LM5085
U6 = 74HC4051D:74HC4051D: 8-channel analog multiplexer/demultiplexer; AVAILABILITY: Unavailable; DESCRIPTION: 1 Circuit IC Switch 8:1 130Ohm 16-SOIC; MF: Toshiba; MP: 74HC4051D; PACKAGE: SOIC-16 Toshiba; PRICE: None
U7 = SparkFun_ACS723_Current_Sensor_Breakout:SPARKFUN-SENSORS_ACS723; PART_#: ACS723ACS723LLCTR-05AB-T2; PROD_ID: IC-13872
X1-X4 = con-jst-zh:B2B-ZR: JST-ZH Connector 2 pol, 1.5mm pitch Package: B2B-ZR Source: http://www.jst-mfg.com/product/pdf/eng/eZH.pdf
X5-X8 X15 = con-jst-xh:JST-XH-02-PIN: JST XH Connector 2 Pin Wire to board connector. Pitch: 2,54 mm, (0.100") Number of pins: 2 Created by Rembrandt Electronics www.rembrandtelectronics.com
X9 X10 X22 = con-jst-xh:JST-XH-06-PIN: JST XH Connector 2 Pin Wire to board connector. Pitch: 2,54 mm, (0.100") Number of pins: 6 Created by Rembrandt Electronics www.rembrandtelectronics.com
X11 X12 = con-jst-xh:JST-XH-03-PIN: JST XH Connector 2 Pin Wire to board connector. Pitch: 2,54 mm, (0.100") Number of pins: 3 Created by Rembrandt Electronics www.rembrandtelectronics.com
X13 X17 X31 = con-jst-zh:B4B-ZR: JST-ZH Connector 4 pol, 1.5mm pitch Package: B4B-ZR Source: http://www.jst-mfg.com/product/pdf/eng/eZH.pdf
X14 X19 X28-X30 = con-jst-zh:B3B-ZR: JST-ZH Connector 3 pol, 1.5mm pitch Package: B3B-ZR Source: http://www.jst-mfg.com/product/pdf/eng/eZH.pdf
X16 = SparkFun-Connectors:CONN_02: Multi connection point. Often used as Generic Header-pin footprint for 0.1 inch spaced/style header connections On any of the 0.1 inch spaced packages, you can populate with these: Break Away Headers - Straight <https://www.sparkfun.com/products/116> (PRT-00116) Break Away Male Headers - Right Angle <https://www.sparkfun.com/products/553> (PRT-00553) Female Headers <https://www.sparkfun.com/products/115> (PRT-00115) Break Away Headers - Machine Pin <https://www.sparkfun.com/products/117> (PRT-00117) Break Away Female Headers - Swiss Machine Pin <https://www.sparkfun.com/products/743> (PRT-00743) For SCREWTERMINALS and SPRING TERMINALS visit here: Screw Terimnals on SparkFun.com <https://www.sparkfun.com/search/results?term=Screw+Terminals> (5mm/3.5mm/2.54mm spacing) This device is also useful as a general connection point to wire up your design to another part of your project. Our various solder wires solder well into these plated through hole pads. Hook-Up Wire - Assortment (Stranded, 22 AWG) <https://www.sparkfun.com/products/11375> (PRT-11375) Hook-Up Wire - Assortment (Solid Core, 22 AWG) <https://www.sparkfun.com/products/11367> (PRT-11367) View the entire wire category on our website here <https://www.sparkfun.com/categories/141> Special notes: Molex polarized connector foot print use with: PRT-08233 with associated crimp pins and housings. 2.54_SCREWTERM for use with PRT-10571. 3.5mm Screw Terminal footprints for PRT-08084 5mm Screw Terminal footprints for use with PRT-08432
X18 = con-jst-zh:B6B-ZR: JST-ZH Connector 6 pol, 1.5mm pitch Package: B6B-ZR Source: http://www.jst-mfg.com/product/pdf/eng/eZH.pdf
X20 X21 = con-jst-zh:B5B-ZR: JST-ZH Connector 5 pol, 1.5mm pitch Package: B5B-ZR Source: http://www.jst-mfg.com/product/pdf/eng/eZH.pdf
X23 X24 = con-jst-xh:JST-XH-04-PIN: JST XH Connector 2 Pin Wire to board connector. Pitch: 2,54 mm, (0.100") Number of pins: 4 Created by Rembrandt Electronics www.rembrandtelectronics.com
X25 = con-jst-xh:JST-XH-05-PIN: JST XH Connector 2 Pin Wire to board connector. Pitch: 2,54 mm, (0.100") Number of pins: 5 Created by Rembrandt Electronics www.rembrandtelectronics.com
X26 = con-jst-zh:B7B-ZR
X27 = con-jst2:?M08B-SRSS-TB: Disconnectable Crimp style connector, 1.0mm pitch 8 contacts
XTAL1 = adafruit:XTAL-4: Classic 4-pin 3.2 x 2.5mm crystal

## Module MD
Ports: M_A(io) M_B(io) !FAULT(io) !SLEEP(io) CURRENT(io) +3V3(io) V_MOTOR(io) GND(io) OUT_A(io) OUT_B(io) AGND(io) VREF(io)
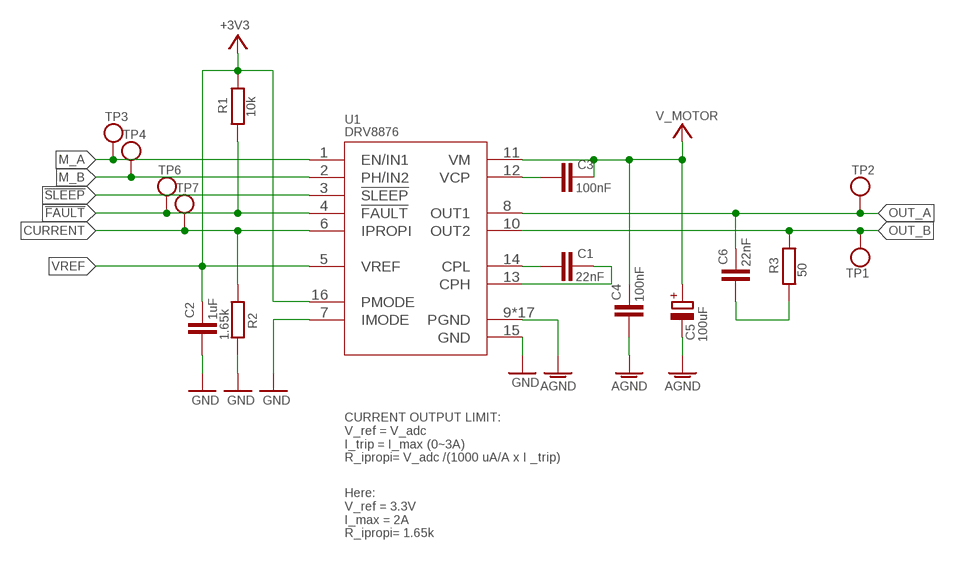
[diagram p5: schematic, module MD, sheet 1]

### Parts
C1  22nF  C-EUC0402  [C0402]
C2  1uF  C-EUC0402  [C0402]
C3  100nF  C-EUC0402  [C0402]
C4  100nF  C-EUC0402  [C0402]
C5  100uF  CPOL-EUE2.5-7  [E2,5-7]
C6  22nF  C-EUC0402  [C0402]
R1  10k  R-EU_R0402  [R0402]
R2  1.65k  R-EU_R0402  [R0402]
R3  50  R-EU_R0402  [R0402]
TP1  TESTPOINTROUND1.5MM  [TESTPOINT_ROUND_1.5MM]
TP2  TESTPOINTROUND1.5MM  [TESTPOINT_ROUND_1.5MM]
TP3  TESTPOINTROUND1.5MM  [TESTPOINT_ROUND_1.5MM]
TP4  TESTPOINTROUND1.5MM  [TESTPOINT_ROUND_1.5MM]
TP6  TESTPOINTROUND1.5MM  [TESTPOINT_ROUND_1.5MM]
TP7  TESTPOINTROUND1.5MM  [TESTPOINT_ROUND_1.5MM]
U1  DRV8876  [IC_TPS92641PWP/NOPB]

### Nets
!FAULT: R1.1 TP6.P$1 U1.4(!FAULT)
!SLEEP: U1.3(!SLEEP)
+3V3: R1.2 U1.16(PMODE)
AGND: C4.2 C5.- U1.9(PGND) U1.17(PGND) U1.18(PGND) U1.19(PGND) U1.20(PGND) U1.21(PGND) U1.22(PGND) U1.23(PGND) U1.24(PGND) U1.25(PGND) U1.26(PGND) U1.27(PGND) U1.28(PGND) U1.29(PGND) U1.30(PGND) U1.31(PGND) U1.32(PGND)
CURRENT: R2.1 TP7.P$1 U1.6(IPROPI)
GND: C2.2 R2.2 U1.7(IMODE) U1.15(GND)
M_A: TP3.P$1 U1.1(EN/IN1)
M_B: TP4.P$1 U1.2(PH/IN2)
N$1: C1.2 U1.14(CPL)
N$2: C1.1 U1.13(CPH)
N$3: C3.2 U1.12(VCP)
N$4: C6.2 R3.1
OUT_A: C6.1 TP2.P$1 U1.8(OUT1)
OUT_B: R3.2 TP1.P$1 U1.10(OUT2)
V_MOTOR: C3.1 C4.1 C5.+ U1.11(VM)
VREF: C2.1 U1.5(VREF)

### Notes on the sheet
- CURRENT OUTPUT LIMIT:
  V_ref = V_adc
  I_trip = I_max (0~3A)
  R_ipropi= V_adc /(1000 uA/A x I _trip)
- Here:  
  V_ref = 3.3V
  I_max = 2A
  R_ipropi= 1.65k

### Library data of the parts
C1-C4 C6 = rcl:C-EU: CAPACITOR, European symbol; SPICEPREFIX: C
C5 = rcl:CPOL-EU: POLARIZED CAPACITOR, European symbol; SPICEPREFIX: C
R1-R3 = rcl:R-EU_: RESISTOR, European symbol; SPICEPREFIX: R
TP1-TP4 TP6 TP7 = microbuilder:TESTPOINT: Test Point Various test points for characterisation and PCB testing TESTPOINT_SMT - Compact Surface Mount Test Point [Digikey: 5016KTR-ND]
U1 = DRV8876:DRV8876

## Module HP
Ports: +12V(io) V+(io) GND(io) IN1(io) IN2(io) !FAULT(io) !SLEEP(io) SO(io) !OC(io) VREF(io)
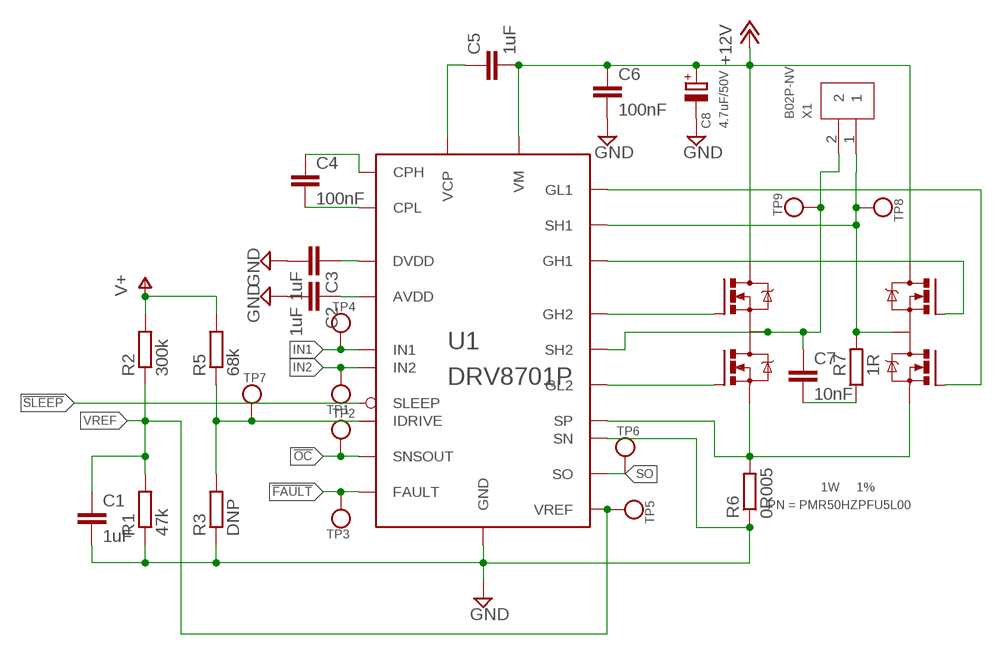
[diagram p6: schematic, module HP, sheet 1]

### Parts
C1  1uF  C-EUC0402  [C0402]
C2  1uF  C-EUC0402  [C0402]
C3  1uF  C-EUC0402  [C0402]
C4  100nF  C-EUC0402  [C0402]
C5  1uF  C-EUC0402  [C0402]
C6  100nF  C-EUC0402  [C0402]
C7  10nF  C-EUC0402  [C0402]
C8  4.7uF/50V  CPOL-EUE2-5  [E2-5]
Q7  AON6978  [DFN-S-6X5-PP]
Q8  AON6978  [DFN-S-6X5-PP]
R1  47k  R-EU_R0402  [R0402]
R2  300k  R-EU_R0402  [R0402]
R3  DNP  R-EU_R0402  [R0402]
R5  68k  R-EU_R0402  [R0402]
R6  0R005  R-EU_R2010  [R2010]
R7  1R  R-EU_R0402  [R0402]
TP1  TESTPOINTROUND1.5MM  [TESTPOINT_ROUND_1.5MM]
TP2  TESTPOINTROUND1.5MM  [TESTPOINT_ROUND_1.5MM]
TP3  TESTPOINTROUND1.5MM  [TESTPOINT_ROUND_1.5MM]
TP4  TESTPOINTROUND1.5MM  [TESTPOINT_ROUND_1.5MM]
TP5  TESTPOINTROUND1.5MM  [TESTPOINT_ROUND_1.5MM]
TP6  TESTPOINTROUND1.5MM  [TESTPOINT_ROUND_1.5MM]
TP7  TESTPOINTROUND1.5MM  [TESTPOINT_ROUND_1.5MM]
TP8  TESTPOINTROUND1.5MM  [TESTPOINT_ROUND_1.5MM]
TP9  TESTPOINTROUND1.5MM  [TESTPOINT_ROUND_1.5MM]
U1  DRV8701P  [QFN24-4X4]
X1  B02P-NV  [B02P-NV]

### Nets
!FAULT: TP3.P$1 U1.9(FAULT)
!OC: TP2.P$1 U1.10(SNSOUT)
!SLEEP: U1.13(SLEEP)
+12V: C5.2 C6.1 C8.+ Q7.P$2(D) Q7.P$3(D) Q7.P$4(D) Q7.P$234A(D) Q7.P$234B(D) Q8.P$2(D) Q8.P$3(D) Q8.P$4(D) Q8.P$234A(D) Q8.P$234B(D) U1.1(VM)
ACT4_DRIVE+: Q8.P$9(DS) R7.2 TP8.P$1 U1.18(SH1) X1.1
ACT4_DRIVE-: C7.1 Q7.P$9(DS) TP9.P$1 U1.23(SH2) X1.2
AVDD: C2.1 U1.7(AVDD)
GND: C1.2 C2.2 C3.2 C6.2 C8.- R1.1 R3.1 R6.1 U1.5(GND) U1.16(GND) U1.20(SN) U1.EXP(GND)
IN1: TP4.P$1 U1.15(IN1)
IN2: TP1.P$1 U1.14(IN2)
N$4: Q8.P$8(GL) U1.19(GL1)
N$40: C4.1 U1.3(CPH)
N$41: C4.2 U1.4(CPL)
N$44: Q7.P$5(S) Q7.P$6(S) Q7.P$7(S) Q8.P$5(S) Q8.P$6(S) Q8.P$7(S) R6.2 U1.21(SP)
N$45: R3.2 R5.1 TP7.P$1 U1.12(IDRIVE)
N$46: Q7.P$8(GL) U1.22(GL2)
N$49: C5.1 U1.2(VCP)
N$50: C3.1 U1.8(DVDD)
N$52: Q8.P$1(GH) U1.17(GH1)
N$53: Q7.P$1(GH) U1.24(GH2)
N$77: C7.2 R7.1
SO: TP6.P$1 U1.11(SO)
V+: R2.2 R5.2
VREF: C1.1 R1.2 R2.1 TP5.P$1 U1.6(VREF)

### Library data of the parts
C1-C7 = rcl:C-EU: CAPACITOR, European symbol
C8 = rcl:CPOL-EU: POLARIZED CAPACITOR, European symbol; SPICEPREFIX: C
Q7 Q8 = AON6978:AON6978
R1-R3 R5 R7 = rcl:R-EU_: RESISTOR, European symbol; SPICEPREFIX: R
R6 = rcl:R-EU_: RESISTOR, European symbol; PN: PMR50HZPFU5L00; POWER: 1W; TOL: 1%
TP1-TP9 = microbuilder:TESTPOINT: Test Point Various test points for characterisation and PCB testing TESTPOINT_SMT - Compact Surface Mount Test Point [Digikey: 5016KTR-ND]
U1 = DRV8701:DRV8701P
X1 = con-jst-nv:B02P-NV